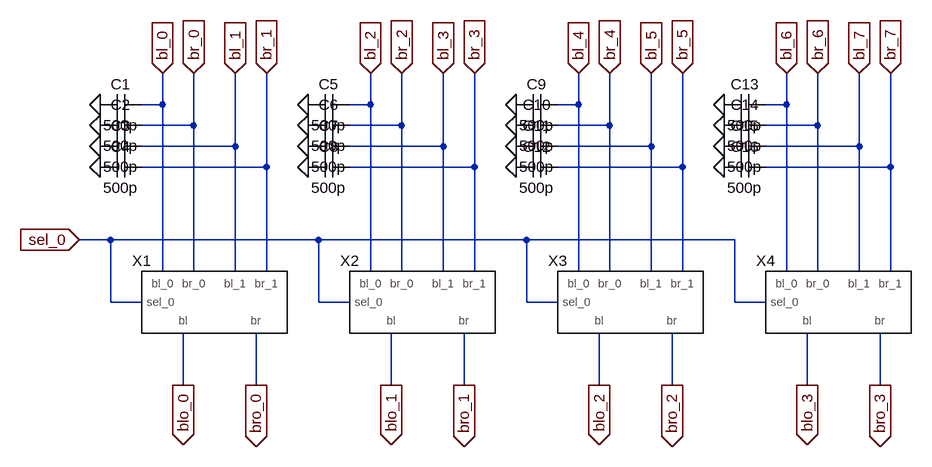
[diagram p0: schematic column_mux.asc]
column_mux.asc, the LTspice schematic file:
Version 4
SHEET 1 1144 680
WIRE -64 -112 -64 -160
WIRE -64 -112 -96 -112
WIRE 256 -112 256 -160
WIRE 256 -112 224 -112
WIRE 576 -112 576 -160
WIRE 576 -112 544 -112
WIRE 896 -112 896 -160
WIRE 896 -112 864 -112
WIRE -16 -80 -16 -160
WIRE -16 -80 -96 -80
WIRE 304 -80 304 -160
WIRE 304 -80 224 -80
WIRE 624 -80 624 -160
WIRE 624 -80 544 -80
WIRE 944 -80 944 -160
WIRE 944 -80 864 -80
WIRE 48 -48 48 -160
WIRE 48 -48 -96 -48
WIRE 368 -48 368 -160
WIRE 368 -48 224 -48
WIRE 688 -48 688 -160
WIRE 688 -48 544 -48
WIRE 1008 -48 1008 -160
WIRE 1008 -48 864 -48
WIRE 96 -16 96 -160
WIRE 96 -16 -96 -16
WIRE 416 -16 416 -160
WIRE 416 -16 224 -16
WIRE 736 -16 736 -160
WIRE 736 -16 544 -16
WIRE 1056 -16 1056 -160
WIRE 1056 -16 864 -16
WIRE -144 96 -192 96
WIRE 176 96 -144 96
WIRE 496 96 176 96
WIRE 816 96 496 96
WIRE -64 144 -64 -112
WIRE -16 144 -16 -80
WIRE 48 144 48 -48
WIRE 96 144 96 -16
WIRE 256 144 256 -112
WIRE 304 144 304 -80
WIRE 368 144 368 -48
WIRE 416 144 416 -16
WIRE 576 144 576 -112
WIRE 624 144 624 -80
WIRE 688 144 688 -48
WIRE 736 144 736 -16
WIRE 896 144 896 -112
WIRE 944 144 944 -80
WIRE 1008 144 1008 -48
WIRE 1056 144 1056 -16
WIRE -144 192 -144 96
WIRE -96 192 -144 192
WIRE 176 192 176 96
WIRE 224 192 176 192
WIRE 496 192 496 96
WIRE 544 192 496 192
WIRE 816 192 816 96
WIRE 864 192 816 192
WIRE -32 320 -32 240
WIRE 80 320 80 240
WIRE 288 320 288 240
WIRE 400 320 400 240
WIRE 608 320 608 240
WIRE 720 320 720 240
WIRE 928 320 928 240
WIRE 1040 320 1040 240
FLAG -64 -160 bl_0
IOPIN -64 -160 In
FLAG 48 -160 bl_1
IOPIN 48 -160 In
FLAG -16 -160 br_0
IOPIN -16 -160 In
FLAG 96 -160 br_1
IOPIN 96 -160 In
FLAG -32 320 blo_0
IOPIN -32 320 Out
FLAG 80 320 bro_0
IOPIN 80 320 Out
FLAG 256 -160 bl_2
IOPIN 256 -160 In
FLAG 368 -160 bl_3
IOPIN 368 -160 In
FLAG 304 -160 br_2
IOPIN 304 -160 In
FLAG 416 -160 br_3
IOPIN 416 -160 In
FLAG 288 320 blo_1
IOPIN 288 320 Out
FLAG 400 320 bro_1
IOPIN 400 320 Out
FLAG 576 -160 bl_4
IOPIN 576 -160 In
FLAG 688 -160 bl_5
IOPIN 688 -160 In
FLAG 624 -160 br_4
IOPIN 624 -160 In
FLAG 736 -160 br_5
IOPIN 736 -160 In
FLAG 608 320 blo_2
IOPIN 608 320 Out
FLAG 720 320 bro_2
IOPIN 720 320 Out
FLAG 896 -160 bl_6
IOPIN 896 -160 In
FLAG 1008 -160 bl_7
IOPIN 1008 -160 In
FLAG 944 -160 br_6
IOPIN 944 -160 In
FLAG 1056 -160 br_7
IOPIN 1056 -160 In
FLAG 928 320 blo_3
IOPIN 928 320 Out
FLAG 1040 320 bro_3
IOPIN 1040 320 Out
FLAG -192 96 sel_0
IOPIN -192 96 In
FLAG -160 -112 0
FLAG -160 -80 0
FLAG -160 -48 0
FLAG -160 -16 0
FLAG 160 -112 0
FLAG 160 -80 0
FLAG 160 -48 0
FLAG 160 -16 0
FLAG 480 -112 0
FLAG 480 -80 0
FLAG 480 -48 0
FLAG 480 -16 0
FLAG 800 -112 0
FLAG 800 -80 0
FLAG 800 -48 0
FLAG 800 -16 0
SYMBOL mux21 16 176 R0
SYMATTR InstName X1
SYMBOL mux21 336 176 R0
SYMATTR InstName X2
SYMBOL mux21 656 176 R0
SYMATTR InstName X3
SYMBOL mux21 976 176 R0
SYMATTR InstName X4
SYMBOL cap -96 -128 R90
WINDOW 0 0 32 VBottom 2
WINDOW 3 32 32 VTop 2
SYMATTR InstName C1
SYMATTR Value 500p
SYMBOL cap -96 -96 R90
WINDOW 0 0 32 VBottom 2
WINDOW 3 32 32 VTop 2
SYMATTR InstName C2
SYMATTR Value 500p
SYMBOL cap -96 -64 R90
WINDOW 0 0 32 VBottom 2
WINDOW 3 32 32 VTop 2
SYMATTR InstName C3
SYMATTR Value 500p
SYMBOL cap -96 -32 R90
WINDOW 0 0 32 VBottom 2
WINDOW 3 32 32 VTop 2
SYMATTR InstName C4
SYMATTR Value 500p
SYMBOL cap 224 -128 R90
WINDOW 0 0 32 VBottom 2
WINDOW 3 32 32 VTop 2
SYMATTR InstName C5
SYMATTR Value 500p
SYMBOL cap 224 -96 R90
WINDOW 0 0 32 VBottom 2
WINDOW 3 32 32 VTop 2
SYMATTR InstName C6
SYMATTR Value 500p
SYMBOL cap 224 -64 R90
WINDOW 0 0 32 VBottom 2
WINDOW 3 32 32 VTop 2
SYMATTR InstName C7
SYMATTR Value 500p
SYMBOL cap 224 -32 R90
WINDOW 0 0 32 VBottom 2
WINDOW 3 32 32 VTop 2
SYMATTR InstName C8
SYMATTR Value 500p
SYMBOL cap 544 -128 R90
WINDOW 0 0 32 VBottom 2
WINDOW 3 32 32 VTop 2
SYMATTR InstName C9
SYMATTR Value 500p
SYMBOL cap 544 -96 R90
WINDOW 0 0 32 VBottom 2
WINDOW 3 32 32 VTop 2
SYMATTR InstName C10
SYMATTR Value 500p
SYMBOL cap 544 -64 R90
WINDOW 0 0 32 VBottom 2
WINDOW 3 32 32 VTop 2
SYMATTR InstName C11
SYMATTR Value 500p
SYMBOL cap 544 -32 R90
WINDOW 0 0 32 VBottom 2
WINDOW 3 32 32 VTop 2
SYMATTR InstName C12
SYMATTR Value 500p
SYMBOL cap 864 -128 R90
WINDOW 0 0 32 VBottom 2
WINDOW 3 32 32 VTop 2
SYMATTR InstName C13
SYMATTR Value 500p
SYMBOL cap 864 -96 R90
WINDOW 0 0 32 VBottom 2
WINDOW 3 32 32 VTop 2
SYMATTR InstName C14
SYMATTR Value 500p
SYMBOL cap 864 -64 R90
WINDOW 0 0 32 VBottom 2
WINDOW 3 32 32 VTop 2
SYMATTR InstName C15
SYMATTR Value 500p
SYMBOL cap 864 -32 R90
WINDOW 0 0 32 VBottom 2
WINDOW 3 32 32 VTop 2
SYMATTR InstName C16
SYMATTR Value 500p

The netlist it stands for:
* column_mux.asc
XX1 bl_0 bl_1 br_0 br_1 sel_0 blo_0 bro_0 mux21  ; pins bl_0 bl_1 br_0 br_1 sel_0 bl br
XX2 bl_2 bl_3 br_2 br_3 sel_0 blo_1 bro_1 mux21  ; pins bl_0 bl_1 br_0 br_1 sel_0 bl br
XX3 bl_4 bl_5 br_4 br_5 sel_0 blo_2 bro_2 mux21  ; pins bl_0 bl_1 br_0 br_1 sel_0 bl br
XX4 bl_6 bl_7 br_6 br_7 sel_0 blo_3 bro_3 mux21  ; pins bl_0 bl_1 br_0 br_1 sel_0 bl br
C1 bl_0 0 500p
C2 br_0 0 500p
C3 bl_1 0 500p
C4 br_1 0 500p
C5 bl_2 0 500p
C6 br_2 0 500p
C7 bl_3 0 500p
C8 br_3 0 500p
C9 bl_4 0 500p
C10 br_4 0 500p
C11 bl_5 0 500p
C12 br_5 0 500p
C13 bl_6 0 500p
C14 br_6 0 500p
C15 bl_7 0 500p
C16 br_7 0 500p
.backanno
.end